# Altium project Controller.PrjPcb
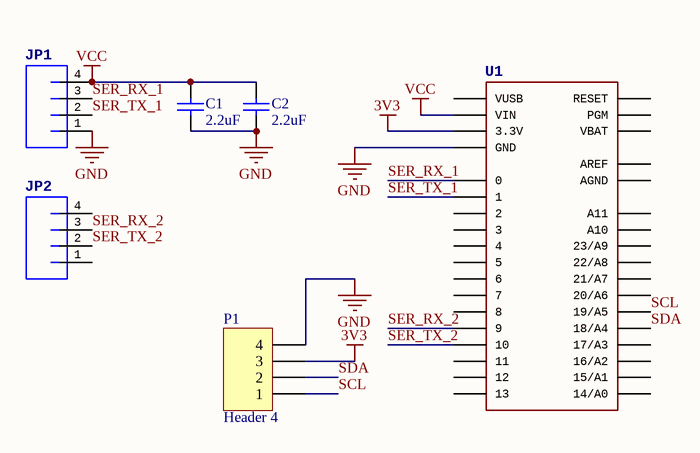
[diagram p0: Controller.SchDoc]
1 sheet, 6 parts. Net scope: global (net labels, ports and power ports of the same name join across sheets).
Board file: Controller.PcbDoc

## Sheet Controller.SchDoc
size A

### Parts
C1  2.2uF  [CAPC0603(1608)100_L]
C2  2.2uF  [CAPC0603(1608)100_L]
JP1  (no value)  [JST-4-PTH-VERT]
JP2  (no value)  [JST-4-PTH-VERT]
P1  Header 4  [HDR1X4]
U1  (no value)  [TEENSY_3.0+4]

### Nets
3V3: P1.3 U1.3.3V_3.3V1(3.3V)
GND: C1.1 C2.1 JP1.1 P1.4 U1.GND_GND1(GND)
VCC: C1.2 C2.2 JP1.4 U1.VIN
SCL: P1.1 U1.19/A5
SDA: P1.2 U1.18/A4
SER_RX_1: JP1.3 U1.0
SER_RX_2: JP2.3 U1.9
SER_TX_1: JP1.2 U1.1
SER_TX_2: JP2.2 U1.10

Not connected (* = marked no-connect by the designer): JP2 1 4; U1 2 3 4 5 6 7 8 11 12 13 14/A0 15/A1 16/A2 17/A3 20/A6 21/A7 22/A8 23/A9 A10 A11 AGND AREF PGM RESET VBAT VUSB

### Library data of the parts
C1 C2 = CMP-1035-02754-1: CAP 2.2uF 6.3V ±10% 0603 (1608 Metric) Thickness 1mm SMD; Case-EIA: 0603; Tolerance: Â±10%; Case-Metric: 1608; Technology: SMT; Value: 2.2uF; Rated Voltage: 6.3 V; Max Thickness: 1 mm
JP1 JP2 = JST_4_VERT
P1 = Header 4: Header, 4-Pin; LatestRevisionDate: 17-Jul-2002; LatestRevisionNote: Re-released for DXP Platform.; Publisher: Altium Limited
U1 = TEENSY_3.0+4: pin to pad: 3.3V 3.3V1>3.3V+3.3V1 GND GND1>GND+GND1